# Altium project LightMod.PrjPcb
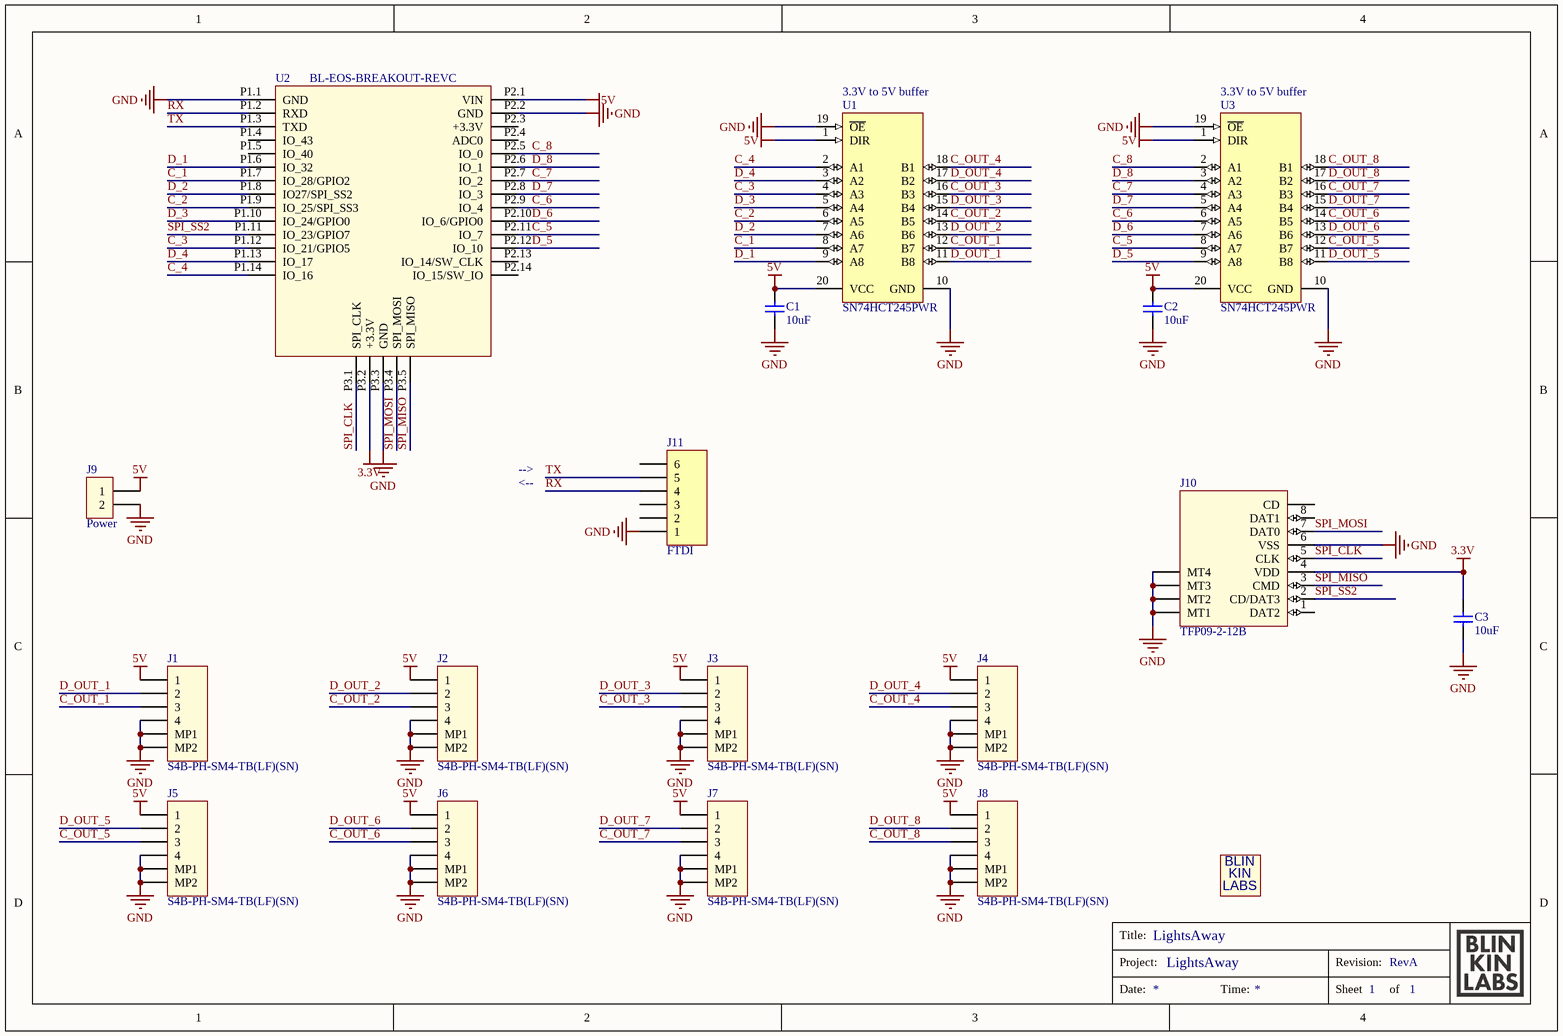
[diagram p0: LightMod.SchDoc]
Project: LightsAway; VersionRevision: RevA
1 sheet, 18 parts. Net scope: global (net labels, ports and power ports of the same name join across sheets).
Board file: LightMod.PcbDoc

## Sheet LightMod.SchDoc: LightsAway
size A4; Organization: Blinkinlabs, LLC; DocumentNumber: 1; SheetNumber: 1; SheetTotal: 1

### Parts
C1  10uF  [CAPC2012X10N]
C2  10uF  [CAPC2012X10N]
C3  10uF  [CAPC2012X10N]
J1  S4B-PH-SM4-TB(LF)(SN)  [S4B-PH-SM4-TB(LF)(SN)]
J2  S4B-PH-SM4-TB(LF)(SN)  [S4B-PH-SM4-TB(LF)(SN)]
J3  S4B-PH-SM4-TB(LF)(SN)  [S4B-PH-SM4-TB(LF)(SN)]
J4  S4B-PH-SM4-TB(LF)(SN)  [S4B-PH-SM4-TB(LF)(SN)]
J5  S4B-PH-SM4-TB(LF)(SN)  [S4B-PH-SM4-TB(LF)(SN)]
J6  S4B-PH-SM4-TB(LF)(SN)  [S4B-PH-SM4-TB(LF)(SN)]
J7  S4B-PH-SM4-TB(LF)(SN)  [S4B-PH-SM4-TB(LF)(SN)]
J8  S4B-PH-SM4-TB(LF)(SN)  [S4B-PH-SM4-TB(LF)(SN)]
J9  Power  [1751248]
J10  TFP09-2-12B  [TFP09-2-12B]
J11  FTDI  [HDR1X6]
L1  BLINKINLABS_LOGO  [BLINKINLABS_LOGO]  (value not drawn)  (no BOM)
U1  SN74HCT245PWR  [PW0020A_L]
U2  BL-EOS-BREAKOUT-REVC  [BL-EOS-BREAKOUT-REVC]
U3  SN74HCT245PWR  [PW0020A_L]

### Nets
3.3V: C3.2 J10.4(VDD) U2.P3.2(+3.3V)
5V: C1.2 C2.2 J1.1 J2.1 J3.1 J4.1 J5.1 J6.1 J7.1 J8.1 J9.1 U1.1(DIR) U1.20(VCC) U2.P2.1(VIN) U3.1(DIR) U3.20(VCC)
GND: C1.1 C2.1 C3.1 J1.4 J1.MP1 J1.MP2 J2.4 J2.MP1 J2.MP2 J3.4 J3.MP1 J3.MP2 J4.4 J4.MP1 J4.MP2 J5.4 J5.MP1 J5.MP2 J6.4 J6.MP1 J6.MP2 J7.4 J7.MP1 J7.MP2 J8.4 J8.MP1 J8.MP2 J9.2 J10.6(VSS) J10.MT1 J10.MT2 J10.MT3 J10.MT4 J11.1 U1.10(GND) U1.19(~{OE}) U2.P1.1(GND) U2.P2.2(GND) U2.P3.3(GND) U3.10(GND) U3.19(~{OE})
C_1: U1.8(A7) U2.P1.7(IO_28/GPIO2)
C_2: U1.6(A5) U2.P1.9(IO_25/SPI_SS3)
C_3: U1.4(A3) U2.P1.12(IO_21/GPIO5)
C_4: U1.2(A1) U2.P1.14(IO_16)
C_5: U2.P2.11(IO_7) U3.8(A7)
C_6: U2.P2.9(IO_4) U3.6(A5)
C_7: U2.P2.7(IO_2) U3.4(A3)
C_8: U2.P2.5(IO_0) U3.2(A1)
C_OUT_1: J1.3 U1.12(B7)
C_OUT_2: J2.3 U1.14(B5)
C_OUT_3: J3.3 U1.16(B3)
C_OUT_4: J4.3 U1.18(B1)
C_OUT_5: J5.3 U3.12(B7)
C_OUT_6: J6.3 U3.14(B5)
C_OUT_7: J7.3 U3.16(B3)
C_OUT_8: J8.3 U3.18(B1)
D_1: U1.9(A8) U2.P1.6(IO_32)
D_2: U1.7(A6) U2.P1.8(IO27/SPI_SS2)
D_3: U1.5(A4) U2.P1.10(IO_24/GPIO0)
D_4: U1.3(A2) U2.P1.13(IO_17)
D_5: U2.P2.12(IO_10) U3.9(A8)
D_6: U2.P2.10(IO_6/GPIO0) U3.7(A6)
D_7: U2.P2.8(IO_3) U3.5(A4)
D_8: U2.P2.6(IO_1) U3.3(A2)
D_OUT_1: J1.2 U1.11(B8)
D_OUT_2: J2.2 U1.13(B6)
D_OUT_3: J3.2 U1.15(B4)
D_OUT_4: J4.2 U1.17(B2)
D_OUT_5: J5.2 U3.11(B8)
D_OUT_6: J6.2 U3.13(B6)
D_OUT_7: J7.2 U3.15(B4)
D_OUT_8: J8.2 U3.17(B2)
RX: J11.4 U2.P1.2(RXD)
SPI_CLK: J10.5(CLK) U2.P3.1(SPI_CLK)
SPI_MISO: J10.3(CMD) U2.P3.5(SPI_MISO)
SPI_MOSI: J10.7(DAT0) U2.P3.4(SPI_MOSI)
SPI_SS2: J10.2(CD/DAT3) U2.P1.11(IO_23/GPIO7)
TX: J11.5 U2.P1.3(TXD)

Not connected (* = marked no-connect by the designer): J10 1(DAT2) 8(DAT1) CD; J11 2 3 6; U2 P1.4(IO_43) P1.5(IO_40) P2.3(+3.3V) P2.4(ADC0) P2.13(IO_14/SW_CLK) P2.14(IO_15/SW_IO)

### Notes on the sheet
- (near U1) 3.3V to 5V buffer
- (near U3) 3.3V to 5V buffer
- <--
- -->
- Title:
- Project:
- Revision:
- Date:
- Time:
- Sheet
- of
- (in symbol BLINKINLABS_LOGO) BLIN; KIN; LABS

### Library data of the parts
C1-C3 = GRM21BR61C106ME15L: CAP CER 10UF 16V X5R 0805; Manufacturer: Murata Electronics North America; Tolerance: ±20%; Datasheets: http://www.murata.com/~/media/webrenewal/support/library/catalog/products/capacitor/mlcc/c02e.pdf; Image: //media.digikey.com/Renders/Murata%20Renders/0805%20(2012%20Metric)%20.85mm.jpg; Digi-Key Part Number: 490-6474-1-ND; Series: GRM; Part Status: Active; Value: 10uF; Voltage: 16V; Temperature Coefficient: X5R; Operating Temperature: -55°C ~ 85°C; Features: -; Applications: General Purpose; Mounting Type: Surface Mount, MLCC; Package / Case: 0805 (2012 Metric); Case/Package: 0805; PartNumber: GRM21BR61C106ME15L
J1-J8 = S4B-PH-SM4-TB(LF)(SN): CONN HEADER SMD R/A 4POS 2MM; Manufacturer: JST; PartNumber: S4B-PH-SM4-TB(LF)(SN)
J9 = 1751248: TERM BLK 2POS SIDE ENT 3.5MM PCB; Manufacturer: Phoenix Contact; PartNumber: 1751248
J10 = TFP09-2-12B: Micro SD Card Connector; Manufacturer: Unknown/Generic; PartNumber: TFP09-2-12B
J11 = Header 6: Header, 6-Pin; LatestRevisionDate: 17-Jul-2002; LatestRevisionNote: Re-released for DXP Platform.; Publisher: Altium Limited
L1 = BLINKINLABS_LOGO: Square logo
U1 U3 = CMP-1620-00542-2: Octal Bus Transceivers With 3-State Outputs, PW0020A, LARGE T&R; Manufacturer: Texas Instruments; VCC(Max)(V): 5.5; Voltage(Nom)(V): 5; VCC(Min)(V): 4.5; Output Type: CMOS; Input Type: TTL; tpd @ Nom Voltage(Max)(ns): 25; Schmitt Trigger: No; Rating: Catalog; Output Drive (IOL/IOH)(Max)(mA): -6/6; ICC @ Nom Voltage(Max)(mA): 0.08; Bits(#): 8; Technology Family: HCT; Code_JEDEC: MO-153; Operating Temperature Range(C): -40 to 85; DatasheetVersion: SCLS020E; F @ Nom Voltage(Max)(Mhz): 25; Generic Part Number: SN74HCT245; PackageReference: PW0020A
U2 = BL-EOS-BREAKOUT-REVC: Manufacturer: Blinkinlabs; PartNumber: QL-EOS-S3-Breakout